# Altium schematic sheet SCH_A2_TempColored.SchDoc
size A2
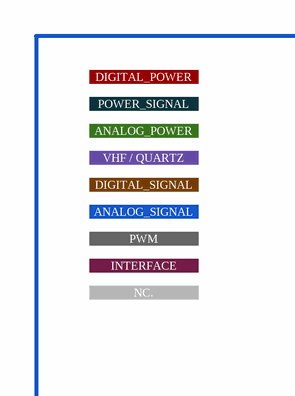
[diagram p0: SCH_A2_TempColored.SchDoc, top left]
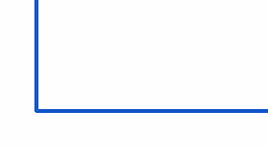
[diagram p1: SCH_A2_TempColored.SchDoc, bottom left]

## Ports
ANALOG_POWER, ANALOG_SIGNAL, DIGITAL_POWER, DIGITAL_SIGNAL, INTERFACE, NC., POWER_SIGNAL, PWM, VHF / QUARTZ